# EAGLE design untitled (EAGLE 5.08)
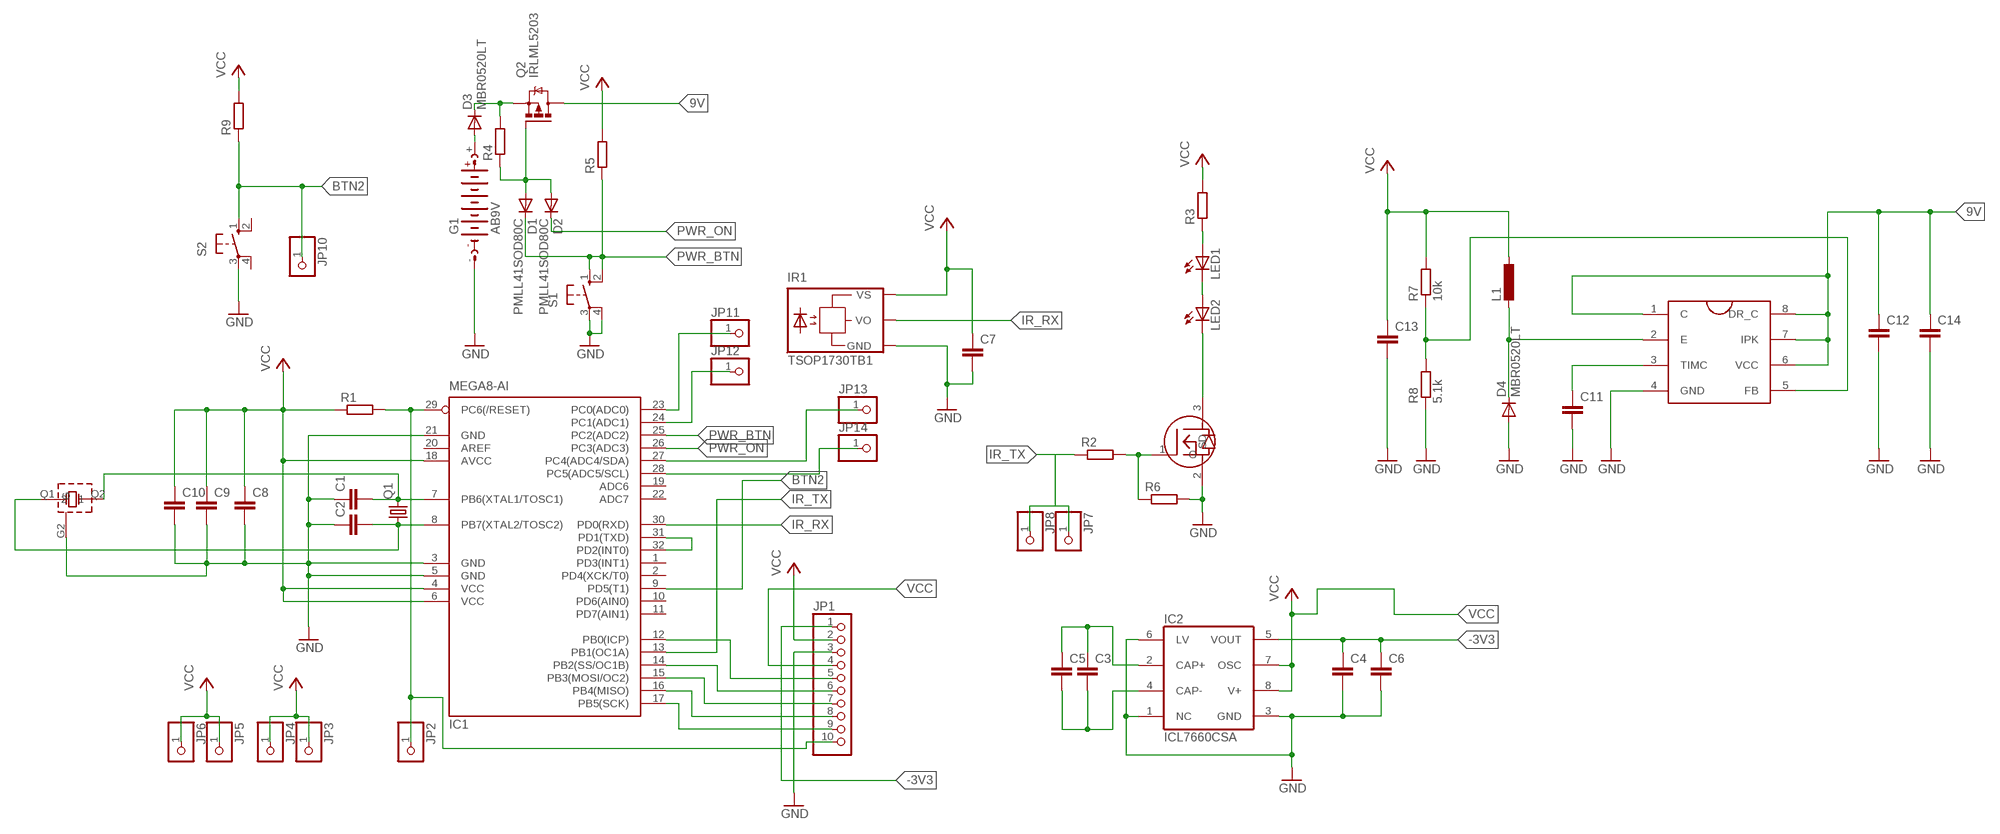
[diagram p0: schematic, sheet 1]

## Parts
C1  C-EUC0805  [C0805]
C2  C-EUC0805  [C0805]
C3  C-EUC0805  [C0805]
C4  C-EUC0805  [C0805]
C5  C-EUC0805  [C0805]
C6  C-EUC0805  [C0805]
C7  C-EUC0805  [C0805]
C8  C-EUC0805  [C0805]
C9  C-EUC0805  [C0805]
C10  C-EUC0805  [C0805]
C11  C-EUC0805  [C0805]
C12  C-EUC0805  [C0805]
C13  C-EUC0805  [C0805]
C14  C-EUC0805  [C0805]
D1  PMLL41SOD80C  [SOD80C]
D2  PMLL41SOD80C  [SOD80C]
D3  MBR0520LT  [SOD123]
D4  MBR0520LT  [SOD123]
G1  AB9V  [AB9V]
IC1  MEGA8-AI  [TQFP32-08]
IC2  ICL7660CSA  [SO08]
IR1  TSOP1730TB1  [TSOP17_TB1]
JP1  PINHD-1X10  [1X10]
JP2  PINHD-1X1  [1X01]
JP3  PINHD-1X1  [1X01]
JP4  PINHD-1X1  [1X01]
JP5  PINHD-1X1  [1X01]
JP6  PINHD-1X1  [1X01]
JP7  PINHD-1X1  [1X01]
JP8  PINHD-1X1  [1X01]
JP10  PINHD-1X1  [1X01]
JP11  PINHD-1X1  [1X01]
JP12  PINHD-1X1  [1X01]
JP13  PINHD-1X1  [1X01]
JP14  PINHD-1X1  [1X01]
L1  L-EUL1812  [L1812]
LED1  LED5MM  [LED5MM]
LED2  LED5MM  [LED5MM]
Q1  CRYSTALHC49S  [HC49/S]
Q2  IRLML5203  [MICRO3]
R1  R-EU_M1206  [M1206]
R2  R-EU_M1206  [M1206]
R3  R-EU_M0805  [M0805]
R4  R-EU_M0805  [M0805]
R5  R-EU_M0805  [M0805]
R6  R-EU_M0805  [M0805]
R7  10k  R-EU_M0805  [M0805]
R8  5.1k  R-EU_M1206  [M1206]
R9  R-EU_M0805  [M0805]
S1  10-XX  [B3F-10XX]
S2  10-XX  [B3F-10XX]
U$1  IRLML2803  [MICRO3]
U$2  MC34063  [SO08]
U$3  KX-7  [KX-7]

## Nets
9V: C12.1 C14.1 Q2.3(D) U$2.1(C) U$2.6(VCC) U$2.7(IPK) U$2.8(DR_C)
-3V3: C4.1 C6.1 IC2.5(VOUT) JP1.1
BTN2: IC1.9(PD5(T1)) JP10.1 R9.1 S2.1(S)
GND: C1.1 C2.1 C4.2 C6.2 C7.2 C8.2 C9.2 C10.2 C11.2 C12.2 C13.2 C14.2 D4.A G1.- IC1.3(GND) IC1.5(GND) IC1.21(GND) IC2.1(NC) IC2.3(GND) IC2.6(LV) IR1.GND JP1.3 R6.2 R8.1 S1.3(P) S1.4(P1) S2.3(P) U$1.2(S) U$2.4(GND) U$3.G2(G)
IR_RX: IC1.30(PD0(RXD)) IR1.VO
IR_TX: IC1.13(PB1(OC1A)) JP7.1 JP8.1 R2.1
N$1: IC1.29(PC6(/RESET)) JP1.10 JP2.1 R1.2
N$2: IC1.17(PB5(SCK)) JP1.9
N$3: IC1.16(PB4(MISO)) JP1.8
N$4: IC1.15(PB3(MOSI/OC2)) JP1.7
N$6: C2.2 IC1.8(PB7(XTAL2/TOSC2)) Q1.1 U$3.Q1
N$7: IC1.14(PB2(SS/OC1B)) JP1.6
N$8: C3.1 C5.1 IC2.2(CAP+)
N$9: C3.2 C5.2 IC2.4(CAP-)
N$10: LED2.K(C) U$1.3(D)
N$11: IC1.12(PB0(ICP)) JP1.5
N$12: D3.A G1.+
N$13: R2.2 R6.1 U$1.1(G)
N$14: IC1.31(PD1(TXD)) IC1.32(PD2(INT0))
N$15: D3.C Q2.2(S) R4.2
N$16: C11.1 U$2.3(TIMC)
N$17: LED1.K(C) LED2.A
N$18: D1.A D2.A Q2.1(G) R4.1
N$19: IC1.23(PC0(ADC0)) JP11.1
N$20: LED1.A R3.1
N$21: IC1.24(PC1(ADC1)) JP12.1
N$22: D4.C L1.2 U$2.2(E)
N$23: IC1.28(PC5(ADC5/SCL)) JP14.1
N$24: R7.1 R8.2 U$2.5(FB)
N$25: IC1.27(PC4(ADC4/SDA)) JP13.1
N$29: C1.2 IC1.7(PB6(XTAL1/TOSC1)) Q1.2 U$3.Q2
PWR_BTN: D1.C IC1.25(PC2(ADC2)) R5.1 S1.1(S) S1.2(S1)
PWR_ON: D2.C IC1.26(PC3(ADC3))
VCC: C7.1 C8.1 C9.1 C10.1 C13.1 IC1.4(VCC) IC1.6(VCC) IC1.18(AVCC) IC2.7(OSC) IC2.8(V+) IR1.VS JP1.2 JP1.4 JP3.1 JP4.1 JP5.1 JP6.1 L1.1 R1.1 R3.2 R5.2 R7.2 R9.2
Unconnected: IC1.1(PD3(INT1)) IC1.2(PD4(XCK/T0)) IC1.10(PD6(AIN0)) IC1.11(PD7(AIN1)) IC1.19(ADC6) IC1.20(AREF) IC1.22(ADC7) S2.2(S1) S2.4(P1)

## Library data of the parts
C1-C14 = rcl:C-EU: CAPACITOR, European symbol
D1 D2 = diode:PMLL41*: High-speed diodes Source: http://www.semiconductors.philips.com/acrobat_download/datasheets/PMLL4150_2.pdf
D3 D4 = diode:MBR0520LT: SCHOTTKY BARRIER RECTIFIER Source: http://onsemi.com .. MBR0520LT1-D.pdf
G1 = battery:AB9V: 9-V BATTERY CLIP
IC1 = atmel:MEGA8: MICROCONTROLLER 8 Kbytes FLASH, 1 kbytes SRAM, 512 bytes EEPROM, USART, 6-channel 10 bit ADC, 2-channel 8 bit ADC Pin compatible with Atmega48, ATMega88, ATMega168 Source: avr.lbr
IC2 = maxim:ICL7660CSA: VOLTAGE CONVERTER
IR1 = telefunken:TSOP17*TB1: TSOP17..TB1 IR Receiver Modules for Remote Control Systems Source: http://www.vishay.com/docs/82042/82042.pdf
JP1 = pinhead:PINHD-1X10: PIN HEADER
JP2-JP8 JP10-JP14 = pinhead:PINHD-1X1: PIN HEADER
L1 = resistor:L-EU: INDUCTOR, European symbol
LED1 LED2 = led:LED: LED OSRAM: - CHIPLED LG R971, LG N971, LY N971, LG Q971, LY Q971, LO R971, LY R971 LH N974, LH R974 LS Q976, LO Q976, LY Q976 LO Q996 - Hyper CHIPLED LW Q18S LB Q993, LB Q99A, LB R99A - SideLED LS A670, LO A670, LY A670, LG A670, LP A670 LB A673, LV A673, LT A673, LW A673 LH A674 LY A675 LS A676, LA A676, LO A676, LY A676, LW A676 LS A679, LY A679, LG A679 - Hyper Micro SIDELED® LS Y876, LA Y876, LO Y876, LY Y876 LT Y87S - SmartLED LW L88C, LW L88S LB L89C, LB L89S, LG L890 LS L89K, LO L89K, LY L89K LS L896, LA L896, LO L896, LY L896 - TOPLED LS T670, LO T670, LY T670, LG T670, LP T670 LSG T670, LSP T670, LSY T670, LOP T670, LYG T670 LG T671, LOG T671, LSG T671 LB T673, LV T673, LT T673, LW T673 LH T674 LS T676, LA T676, LO T676, LY T676, LB T676, LH T676, LSB T676, LW T676 LB T67C, LV T67C, LT T67C, LS T67K, LO T67K, LY T67K, LW E67C LS E67B, LA E67B, LO E67B, LY E67B, LB E67C, LV E67C, LT E67C LW T67C LS T679, LY T679, LG T679 LS T770, LO T770, LY T770, LG T770, LP T770 LB T773, LV T773, LT T773, LW T773 LH T774 LS E675, LA E675, LY E675, LS T675 LS T776, LA T776, LO T776, LY T776, LB T776 LHGB T686 LT T68C, LB T68C - Hyper Mini TOPLED® LB M676 - Mini TOPLED Santana® LG M470 LS M47K, LO M47K, LY M47K Source: http://www.osram.convergy.de LUXEON: - LUMILED® LXK2-PW12-R00, LXK2-PW12-S00, LXK2-PW14-U00, LXK2-PW14-V00 LXK2-PM12-R00, LXK2-PM12-S00, LXK2-PM14-U00 LXK2-PE12-Q00, LXK2-PE12-R00, LXK2-PE12-S00, LXK2-PE14-T00, LXK2-PE14-U00 LXK2-PB12-K00, LXK2-PB12-L00, LXK2-PB12-M00, LXK2-PB14-N00, LXK2-PB14-P00, LXK2-PB14-Q00 LXK2-PR12-L00, LXK2-PR12-M00, LXK2-PR14-Q00, LXK2-PR14-R00 LXK2-PD12-Q00, LXK2-PD12-R00, LXK2-PD12-S00 LXK2-PH12-R00, LXK2-PH12-S00 LXK2-PL12-P00, LXK2-PL12-Q00, LXK2-PL12-R00 Source: www.luxeon.com KINGBRIGHT: KA-3528ASYC Source: www.kingbright.com
Q1 = crystal:CRYSTAL: CRYSTAL
Q2 = transistor-power:IRLML5203: HEXFET P-Channel Power MOSFET
R1-R9 = resistor:R-EU_: RESISTOR, European symbol
S1 S2 = switch-omron:10-XX: OMRON SWITCH
U$1 = transistor-power:IRLML2803
U$2 = stabil:MC34063
U$3 = ARM:KX-7

## Board
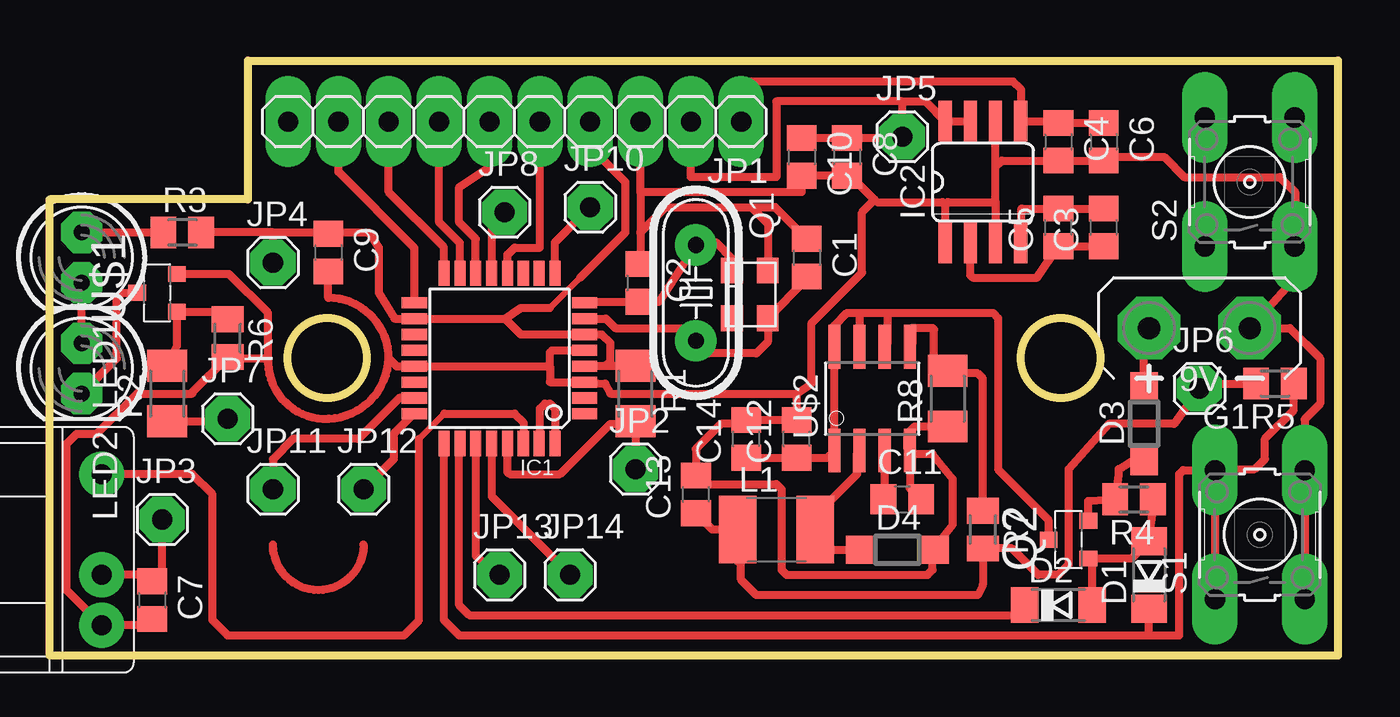
[diagram p1: board, top side]
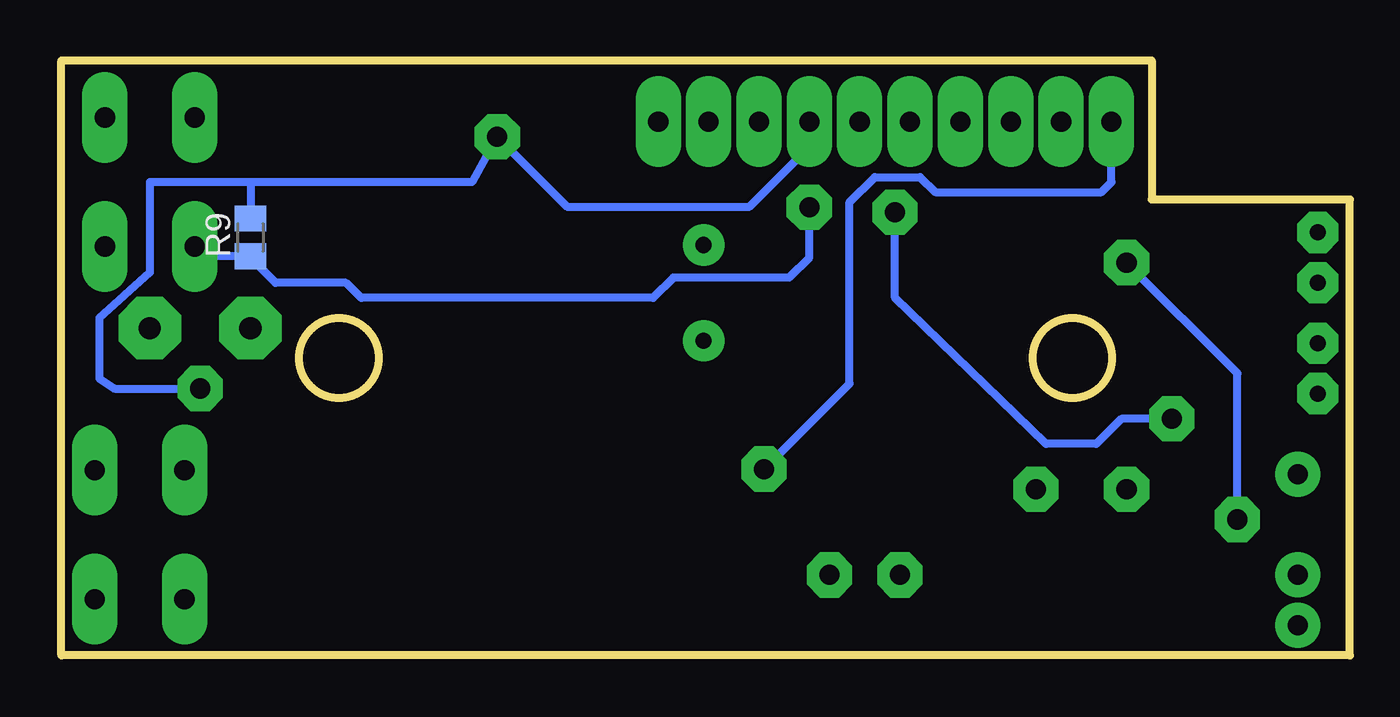
[diagram p2: board, bottom side, seen from below]

Size 65 x 30 mm. Coordinates in mm from the lower left corner, seen from the top.
Outline: 0,0 0,23 10,23 10,30 65,30 65,0 0,0
Outline: circle at 14,15 radius 2
Outline: circle at 51,15 radius 2
Copper layers (1*16): Top 0.035mm / dielectric 1.5mm / Bottom 0.035mm
Design rules "default *": minimum track width 0.2mm, minimum drill 32mil, track to track 0.25mm, track to pad 0.25mm, pad to pad 0.241mm, via to via 0.24mm, smd to smd 0.23mm, copper to edge 0.15mm, drill to drill 0.15mm, minimum pad ring 25mil, minimum via ring 12mil, stop-mask expansion 4mil, vias tented up to drill 0mil, thermal gap 10mil

### Footprints (pad centres in the part's own frame; a part is rotated, then mirrored left to right if it is on the bottom)
C0805 = smd 1.3 x 1.5: 1 -0.95,0; 2 0.95,0
SOD80C = smd 1.4 x 1.8: A 1.7,0; C -1.7,0
SOD123 = smd 1.4 x 1.4: A 1.9,0; C -1.9,0
AB9V = drill 1.118 pad 3.15 octagon: + 0,2.54; - 0,-2.54
TQFP32-08 = smd 1.27 x 0.559: 1 -4.293,2.8; 2 -4.293,2; 3 -4.293,1.2; 4 -4.293,0.4; 5 -4.293,-0.4; 6 -4.293,-1.2; 7 -4.293,-2; 8 -4.293,-2.8; 17 4.293,-2.8; 18 4.293,-2; 19 4.293,-1.2; 20 4.293,-0.4; 21 4.293,0.4; 22 4.293,1.2; 23 4.293,2; 24 4.293,2.8 | smd 0.559 x 1.27: 9 -2.8,-4.293; 10 -2,-4.293; 11 -1.2,-4.293; 12 -0.4,-4.293; 13 0.4,-4.293; 14 1.2,-4.293; 15 2,-4.293; 16 2.8,-4.293; 25 2.8,4.293; 26 2,4.293; 27 1.2,4.293; 28 0.4,4.293; 29 -0.4,4.293; 30 -1.2,4.293; 31 -2,4.293; 32 -2.8,4.293
SO08 = smd 0.66 x 2.032: 1 -1.905,-3.073; 2 -0.635,-3.073; 3 0.635,-3.073; 4 1.905,-3.073; 5 1.905,3.073; 6 0.635,3.073; 7 -0.635,3.073; 8 -1.905,3.073
TSOP17_TB1 = drill 1 pad 1.676 round: GND 0,-3.81; VO 0,3.81; VS 0,-1.27
1X10 = drill 1.016 long: 1 -11.43,0; 2 -8.89,0; 3 -6.35,0; 4 -3.81,0; 5 -1.27,0; 6 1.27,0; 7 3.81,0; 8 6.35,0; 9 8.89,0; 10 11.43,0
1X01 = drill 1.016 octagon: 1 0,0
L1812 = smd 1.9 x 3.4: 1 -1.95,0; 2 1.95,0
LED5MM = drill 0.813 octagon: A -1.27,0; K 1.27,0
HC49/S = drill 0.813 round: 1 -2.413,0; 2 2.413,0
MICRO3 = smd 0.8 x 0.9: 1 -0.95,-1; 2 0.95,-1; 3 0,1
M1206 = smd 1.6 x 2: 1 -1.4,0; 2 1.4,0
M0805 = smd 1.3 x 1.6: 1 -0.95,0; 2 0.95,0
B3F-10XX = drill 1.016 long: 1 -3.251,2.261; 2 3.251,2.261; 3 -3.251,-2.261; 4 3.251,-2.261
SO08' = smd 0.61 x 2.21: 1 -1.905,-2.616; 2 -0.635,-2.616; 3 0.635,-2.616; 4 1.905,-2.616; 5 1.905,2.616; 6 0.635,2.616; 7 -0.635,2.616; 8 -1.905,2.616
KX-7 = smd 1.3 x 1.1: G1 2.8,0.3; G2 0.4,2.1; Q1 0.4,0.3; Q2 2.8,2.1

### Placement (x,y rotation side)
C1  38.19,20.07 270 top
C2  29.81,18.8 270 top
C3  53.18,21.59 90 top
C4  50.89,25.91 270 top
C5  50.89,21.59 90 top
C6  53.18,25.91 270 top
C7  5.17,2.79 270 top
C8  40.23,25.15 270 top
C9  14.06,20.32 270 top
C10  37.94,25.15 270 top
C11  43.02,7.87 0 top
C12  37.69,10.92 90 top
C13  32.61,8.13 90 top
C14  35.15,10.92 90 top
D1  55.47,4.06 90 top
D2  50.89,2.54 0 top
D3  55.21,11.68 90 top
D4  42.77,5.33 0 top
G1  58.01,16.51 90 top
IC1  22.7,14.99 180 top
IC2  47.08,23.88 0 top
IR1  2.63,5.33 0 top
JP1  23.46,26.92 180 top
JP2  29.56,9.4 0 top
JP3  5.68,6.86 0 top
JP4  11.27,19.81 0 top
JP5  43.02,26.16 0 top
JP6  58.01,13.46 0 top
JP7  8.98,11.94 0 top
JP8  22.95,22.35 0 top
JP10  27.27,22.61 0 top
JP11  11.27,8.38 0 top
JP12  15.84,8.38 0 top
JP13  22.7,4.06 0 top
JP14  26.26,4.06 0 top
L1  36.67,6.35 0 top
LED1  1.62,20.07 270 top
LED2  1.62,14.48 270 top
Q1  32.61,18.29 270 top
Q2  51.4,5.84 90 top
R1  29.56,13.21 270 top
R2  5.94,13.21 90 top
R3  6.7,21.34 0 top
R4  54.7,7.87 180 top
R5  61.82,13.72 180 top
R6  8.98,16 270 top
R7  47.08,6.35 270 top
R8  45.31,12.95 90 top
R9  55.47,21.08 90 bottom
S1  61.05,6.1 90 top
S2  60.55,23.88 90 top
U$1  5.43,18.29 90 top
U$2  MC34063  [SO08']  41.5,12.95 0 top
U$3  34.13,19.81 270 top

### Tracks (layer width: path | path; a pad name or v marks a point on that pad's centre or on a via)
9V
  Top 0.406: C14.1 C12.1 39.23,9.97 U$2.1 U$2.8 39.59,16.64 40.23,17.27 40.73,17.27 | 40.73,17.27 42.26,17.27 | 42.26,17.27 42.26,15.7 U$2.6 | U$2.7 40.86,17.14 40.73,17.27 | 42.26,17.27 47.59,17.27 47.85,17.02 47.85,9.4 50.39,6.86 50.39,5.86 Q2.3
-3V3
  Top 0.406: C6.1 C4.1 50.8,26.95 IC2.5 48.99,28.57 48.61,28.96 34.89,28.96 JP1.1
BTN2
  Top 0.406: IC1.9 25.5,20.83 JP10.1
  Bottom 0.406: S2.1 57.54,20.13 R9.1 55.47,20.07 54.2,18.8 50.64,18.8 49.88,18.03 35.15,18.03 34.13,19.05 28.29,19.05 27.27,20.07 JP10.1
GND
  Top 0.406: C7.2 4.85,1.52 IR1.GND 0.86,3.3 0.86,10.67 1.36,11.18 2.38,11.18 4.41,13.21 7.21,13.21 7.21,13.27 R6.2 9.3,14.99 11.02,14.99 | U$1.2 9.05,19.24 11.02,17.27 11.02,14.99 | 47.72,24.64 IC2.6 | 47.72,22.86 47.72,24.64 | 47.72,22.86 IC2.3 | 45.18,22.73 IC2.1 | 45.18,22.73 45.31,22.86 47.72,22.86 | 47.72,24.64 48.04,24.96 C4.2 C6.2 53.37,25.15 56.23,25.15 57.24,24.13 62.07,24.13 62.83,23.37 62.83,20.9 S2.3 | 25.24,14.59 IC1.21 17.51,14.59 17.11,14.99 | 25.24,14.59 25.24,13.79 IC1.3 28.03,13.72 28.29,13.21 37.69,13.21 | 17.11,14.99 arc-90 13.81,11.94 arc-90 11.02,14.99 | 29.81,23.37 37.94,23.37 C10.2 C8.2 | S1.3 S1.4 63.31,11.91 64.1,12.7 64.1,14.99 62.58,16.51 G1.- 62.81,19.02 S2.3 | 17.11,14.99 arc90 14.06,18.03 C9.2 | C8.2 40.41,24.2 41.62,22.99 | 41.62,22.99 41.75,22.86 45.05,22.86 45.18,22.73 | 29.81,23.37 JP1.3 | C8.2 39.97,23.94 | 29.81,23.37 29.81,21.34 | 29.81,21.34 C2.1 | U$2.4 43.4,8.44 C11.2 | U$2.4 43.58,10.16 44.54,10.16 45.56,8.89 45.56,6.6 44.67,5.46 D4.A 44.54,5.21 44.54,4.32 44.29,4.06 37.18,4.06 36.92,4.32 36.92,8.38 36.67,8.64 33.3,8.64 C13.2 32.61,10.41 33.88,11.68 34.96,11.68 C14.2 C12.2 | R8.1 43.65,11.55 43.27,11.18 43.27,10.46 U$2.4 | C12.2 37.87,11.87 37.94,11.94 | 37.69,13.21 38.45,13.72 38.45,16.76 40.99,19.3 40.99,22.35 41.62,22.99 | 37.69,13.21 C12.2 | S2.3 62.83,20.85 | IC1.5 25.35,15.39 25.24,15.28 25.24,14.59 | 29.81,21.34 31.08,22.61 35.4,22.61 | 35.4,22.61 36.6,22.61 C1.1 | U$3.G2 36.23,21.78 35.4,22.61
IR_RX
  Top 0.305: 18.64,10.92 19.91,12.19
  Top 0.406: IC1.30 23.9,11.75 23.46,12.19 19.91,12.19 | IR1.VO 7.21,9.14 8.22,8.13 8.22,1.78 8.98,1.02 17.87,1.02 18.64,1.78 18.64,10.92
IR_TX
  Top 0.406: IC1.13 22.3,22.24 JP8.1 | R2.1 8.85,11.81 JP7.1
  Bottom 0.406: JP7.1 11.52,11.94 12.79,10.67 15.33,10.67 22.95,18.03 JP8.1
N$1
  Top 0.406: IC1.29 23.1,9.25 23.21,9.14 25.75,9.14 28.29,11.68 29.43,11.68 R1.2 JP2.1
  Bottom 0.406: JP2.1 25.24,13.72 25.24,22.86 23.97,24.13 21.68,24.13 20.92,23.37 12.54,23.37 12.03,23.88 JP1.10
N$2
  Top 0.406: IC1.17 18.41,20.55 14.57,24.38 JP1.9
N$3
  Top 0.406: IC1.16 19.9,20.58 17.11,23.37 JP1.8
N$4
  Top 0.406: IC1.15 20.7,20.8 19.65,21.84 JP1.7
N$6
  Top 0.406: IC1.8 27.05,17.85 C2.2 30.77,17.85 Q1.1 | Q1.1 32.99,20.83 | U$3.Q1 34.43,20.02 33.62,20.83 32.73,20.83 Q1.1
N$7
  Top 0.406: IC1.14 21.5,21.01 20.67,21.84 20.67,23.62 22.19,24.64 JP1.6
N$8
  Top 0.406: IC2.2 46.45,19.18 46.58,19.05 49.81,19.05 C5.1 C3.1
N$9
  Top 0.406: C3.2 C5.2 49.03,22.54 IC2.4
N$10
  Top 0.406: U$1.3 3.65,18.29 3.4,18.03 3.4,14.99 LED2.K
N$11
  Top 0.406: IC1.12 23.1,20.21 23.46,20.57 24.73,20.57 JP1.5
N$12
  Top 0.406: D3.A 55.21,16.26 G1.+
N$13
  Top 0.406: R2.2 6.43,15.61 U$1.1 8.6,17.34 R6.1
N$14
  Top 0.406: IC1.32 25.5,12.44 25.24,12.7 24.99,12.7 24.73,12.45 24.73,10.72 IC1.31
N$15
  Top 0.406: D3.C 54.58,9.78 53.94,9.4 53.94,9.08 R4.2 52.4,7.79 Q2.2
N$16
  Top 0.406: U$2.3 42.13,7.93 C11.1
N$17
  Top 0.406: LED2.A LED1.K
N$18
  Top 0.406: D2.A 52.59,4.83 Q2.1 54.59,4.89 D1.A 55.72,7.69 R4.1
N$19
  Top 0.406: IC1.23 17.65,12.99 15.59,10.92 12.29,10.92 11.27,9.91 JP11.1
N$20
  Top 0.406: LED1.A R3.1
N$21
  Top 0.406: IC1.24 18.38,12.19 17.37,11.18 17.37,9.91 JP12.1
N$22
  Top 0.406: D4.C 39.38,5.33 L1.2 38.37,6.78 40.73,9.14 40.73,10.21 U$2.2
N$23
  Top 0.406: IC1.28 22.3,8.02 JP14.1
N$24
  Top 0.406: U$2.5 43.53,15.7 43.53,16.51 44.54,16.51 44.62,16.44 44.62,14.35 R8.2 45.44,14.22 46.83,14.22 47.08,13.97 R7.1
N$25
  Top 0.406: IC1.27 21.5,5.01 JP13.1
N$26
  Top 0.406: 15.84,5.59 arc-180 11.27,5.59
N$29
  Top 0.406: IC1.7 28.07,16.99 28.54,16.51 32.23,16.51 Q1.2 33.24,15.24 35.65,15.24 36.23,15.82 U$3.Q2 38.19,18.98 C1.2
PWR_BTN
  Top 0.406: S1.2 S1.1 | S1.2 58.84,9.4 60.8,9.4 61.31,9.91 61.31,10.92 62.77,12.38 R5.1 | S1.2 57.19,9.35 56.99,9.14 56.99,1.02 55.47,1.02 | 55.47,1.02 D1.C | IC1.25 19.9,1.78 20.67,1.02 55.47,1.02
PWR_ON
  Top 0.406: IC1.26 20.67,10.66 20.67,2.54 21.18,2.03 48.69,2.03 D2.C
VCC
  Top 0.305: 25.24,17.53 26.76,19.05
  Top 0.406: IR1.VS 4.85,4.06 C7.1 5.68,4.25 JP3.1 | IC2.7 IC2.8 44.19,27.94 43.02,27.94 | 28.03,14.61 27.02,14.61 IC1.4 | 28.03,14.61 R1.1 | 28.03,14.61 28.29,14.86 28.29,15.75 27.85,16.19 IC1.6 23.79,16.19 22.99,16.99 | 22.99,16.99 IC1.18 17.4,16.99 16.6,18.29 16.6,20.57 16.1,21.34 14.38,21.34 C9.1 13.74,21.34 11.27,21.34 | 43.02,27.94 36.67,27.94 36.67,24.13 32.35,24.13 JP1.2 | 11.27,21.34 R3.2 | JP4.1 11.27,21.34 | C10.1 C8.1 42.95,26.1 JP5.1 43.02,27.94 | L1.1 35.15,6.27 | L1.1 33.43,6.35 C13.1 | L1.1 34.72,4.74 | R5.2 58.51,13.72 JP6.1 56.74,11.68 53.43,11.68 51.4,9.4 51.4,4.57 50.89,4.06 49.88,4.06 48.54,5.4 R7.2 47.08,3.56 46.83,3.05 35.65,3.05 34.89,3.81 34.89,5.92 L1.1 | JP1.4 27.27,25.65 29.05,23.88 29.05,21.34 26.76,19.05 | 25.24,17.53 23.78,17.53 22.99,16.99
  Bottom 0.406: JP3.1 5.68,14.22 JP4.1 | 55.47,23.88 44.29,23.88 JP5.1 39.46,22.61 30.32,22.61 27.27,25.65 JP1.4 | 55.47,23.88 60.55,23.88 60.55,19.3 63.09,17.02 63.09,13.97 62.32,13.46 JP6.1 | 55.47,23.88 R9.2